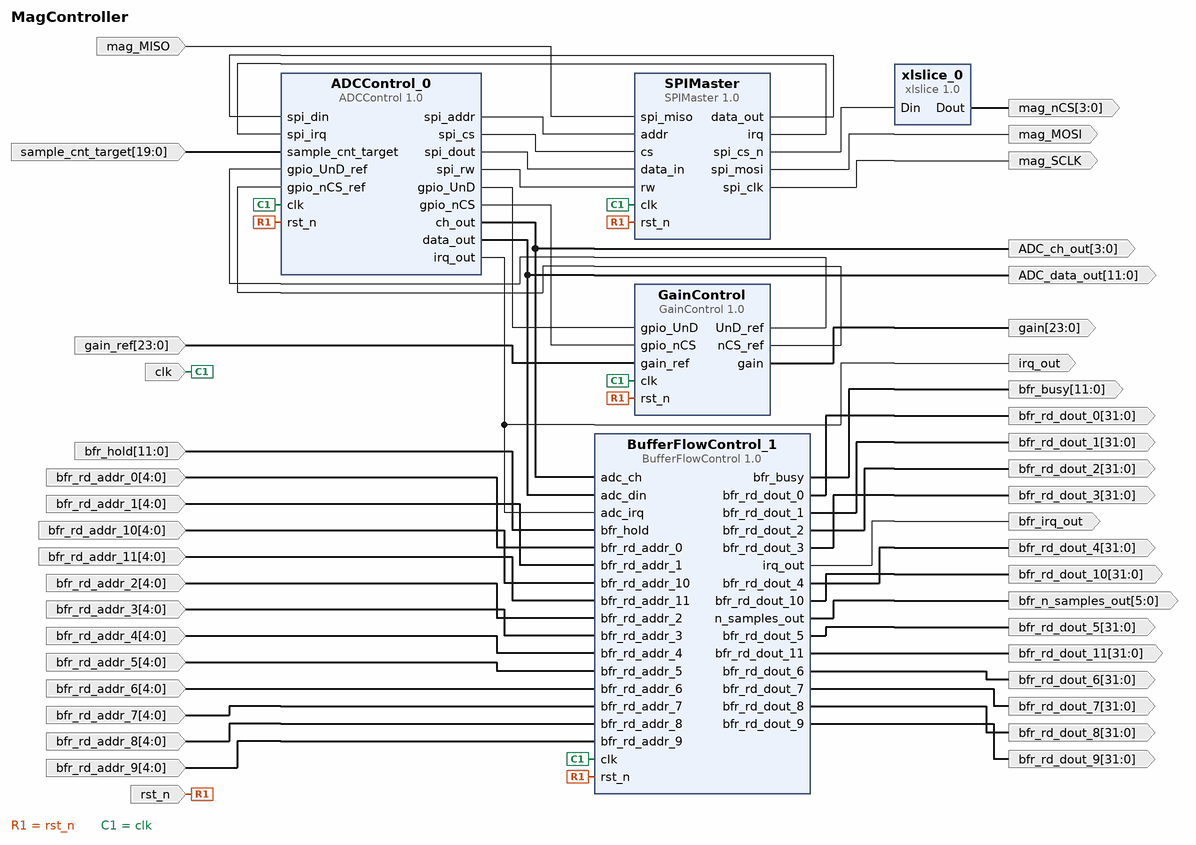
[diagram p0: block diagram of the top level]
# Vivado block design MagController, xczu3eg-sbva484-1-i, Vivado 2020.2
create_bd_design MagController

create_bd_port -dir O -from 3 -to 0 mag_nCS
create_bd_port -dir I mag_MISO
create_bd_port -dir I -type clk clk
create_bd_port -dir I -type rst rst_n
create_bd_port -dir O -type clk mag_SCLK
create_bd_port -dir O mag_MOSI
create_bd_port -dir O -from 11 -to 0 bfr_busy
create_bd_port -dir O -from 3 -to 0 ADC_ch_out
create_bd_port -dir O -from 11 -to 0 ADC_data_out
create_bd_port -dir O irq_out
create_bd_port -dir O bfr_irq_out
create_bd_port -dir O -from 5 -to 0 bfr_n_samples_out
create_bd_port -dir I -from 11 -to 0 bfr_hold
create_bd_port -dir O -from 31 -to 0 bfr_rd_dout_10
create_bd_port -dir I -from 4 -to 0 bfr_rd_addr_2
create_bd_port -dir I -from 4 -to 0 bfr_rd_addr_10
create_bd_port -dir I -from 4 -to 0 bfr_rd_addr_11
create_bd_port -dir O -from 31 -to 0 bfr_rd_dout_1
create_bd_port -dir O -from 31 -to 0 bfr_rd_dout_2
create_bd_port -dir I -from 4 -to 0 bfr_rd_addr_4
create_bd_port -dir I -from 4 -to 0 bfr_rd_addr_1
create_bd_port -dir O -from 31 -to 0 bfr_rd_dout_6
create_bd_port -dir I -from 4 -to 0 bfr_rd_addr_3
create_bd_port -dir O -from 31 -to 0 bfr_rd_dout_11
create_bd_port -dir O -from 31 -to 0 bfr_rd_dout_4
create_bd_port -dir I -from 4 -to 0 bfr_rd_addr_6
create_bd_port -dir O -from 31 -to 0 bfr_rd_dout_5
create_bd_port -dir O -from 31 -to 0 bfr_rd_dout_8
create_bd_port -dir I -from 4 -to 0 bfr_rd_addr_5
create_bd_port -dir O -from 31 -to 0 bfr_rd_dout_3
create_bd_port -dir I -from 4 -to 0 bfr_rd_addr_8
create_bd_port -dir O -from 31 -to 0 bfr_rd_dout_7
create_bd_port -dir I -from 4 -to 0 bfr_rd_addr_7
create_bd_port -dir O -from 31 -to 0 bfr_rd_dout_0
create_bd_port -dir I -from 4 -to 0 bfr_rd_addr_0
create_bd_port -dir I -from 4 -to 0 bfr_rd_addr_9
create_bd_port -dir O -from 31 -to 0 bfr_rd_dout_9
create_bd_port -dir I -from 23 -to 0 gain_ref
create_bd_port -dir O -from 23 -to 0 gain
create_bd_port -dir I -from 19 -to 0 sample_cnt_target

create_bd_cell -type ip -vlnv DIII:PL-Mag-Sensor:SPIMaster:1.0 SPIMaster
create_bd_cell -type ip -vlnv DIII:PL-Mag-Sensor:GainControl:1.0 GainControl
create_bd_cell -type ip -vlnv xilinx.com:ip:xlslice:1.0 xlslice_0
set_property -dict {CONFIG.DIN_FROM 3 CONFIG.DIN_WIDTH 8 CONFIG.DOUT_WIDTH 4} [get_bd_cells xlslice_0]
create_bd_cell -type ip -vlnv DIII:PL-Mag-Sensor:BufferFlowControl:1.0 BufferFlowControl_1
create_bd_cell -type ip -vlnv DIII:PL-Mag-Sensor:ADCControl:1.0 ADCControl_0

# ---- connections ----

connect_bd_net -net spi_miso_0_1 [get_bd_ports mag_MISO] [get_bd_pins SPIMaster/spi_miso]
connect_bd_net -net rst_n_0_1 [get_bd_ports rst_n] \
  [get_bd_pins SPIMaster/rst_n] [get_bd_pins GainControl/rst_n] [get_bd_pins BufferFlowControl_1/rst_n] \
  [get_bd_pins ADCControl_0/rst_n]
connect_bd_net -net clk_0_1 [get_bd_ports clk] \
  [get_bd_pins SPIMaster/clk] [get_bd_pins GainControl/clk] [get_bd_pins BufferFlowControl_1/clk] \
  [get_bd_pins ADCControl_0/clk]
connect_bd_net [get_bd_pins SPIMaster/spi_clk] [get_bd_ports mag_SCLK]
connect_bd_net [get_bd_pins SPIMaster/spi_mosi] [get_bd_ports mag_MOSI]
connect_bd_net [get_bd_pins GainControl/UnD_ref] [get_bd_pins ADCControl_0/gpio_UnD_ref]
connect_bd_net [get_bd_pins GainControl/nCS_ref] [get_bd_pins ADCControl_0/gpio_nCS_ref]
connect_bd_net [get_bd_pins SPIMaster/data_out] [get_bd_pins ADCControl_0/spi_din]
connect_bd_net [get_bd_pins SPIMaster/irq] [get_bd_pins ADCControl_0/spi_irq]
connect_bd_net [get_bd_pins ADCControl_0/ch_out] [get_bd_ports ADC_ch_out] [get_bd_pins BufferFlowControl_1/adc_ch]
connect_bd_net [get_bd_pins ADCControl_0/data_out] [get_bd_ports ADC_data_out] [get_bd_pins BufferFlowControl_1/adc_din]
connect_bd_net [get_bd_pins ADCControl_0/gpio_UnD] [get_bd_pins GainControl/gpio_UnD]
connect_bd_net [get_bd_pins ADCControl_0/gpio_nCS] [get_bd_pins GainControl/gpio_nCS]
connect_bd_net [get_bd_pins ADCControl_0/irq_out] [get_bd_ports irq_out] [get_bd_pins BufferFlowControl_1/adc_irq]
connect_bd_net [get_bd_pins ADCControl_0/spi_addr] [get_bd_pins SPIMaster/addr]
connect_bd_net [get_bd_pins ADCControl_0/spi_cs] [get_bd_pins SPIMaster/cs]
connect_bd_net [get_bd_pins ADCControl_0/spi_dout] [get_bd_pins SPIMaster/data_in]
connect_bd_net [get_bd_pins ADCControl_0/spi_rw] [get_bd_pins SPIMaster/rw]
connect_bd_net [get_bd_pins SPIMaster/spi_cs_n] [get_bd_pins xlslice_0/Din]
connect_bd_net [get_bd_pins xlslice_0/Dout] [get_bd_ports mag_nCS]
connect_bd_net [get_bd_pins BufferFlowControl_1/bfr_busy] [get_bd_ports bfr_busy]
connect_bd_net [get_bd_pins BufferFlowControl_1/bfr_rd_dout_0] [get_bd_ports bfr_rd_dout_0]
connect_bd_net [get_bd_pins BufferFlowControl_1/bfr_rd_dout_1] [get_bd_ports bfr_rd_dout_1]
connect_bd_net [get_bd_pins BufferFlowControl_1/bfr_rd_dout_10] [get_bd_ports bfr_rd_dout_10]
connect_bd_net [get_bd_pins BufferFlowControl_1/bfr_rd_dout_11] [get_bd_ports bfr_rd_dout_11]
connect_bd_net [get_bd_pins BufferFlowControl_1/bfr_rd_dout_2] [get_bd_ports bfr_rd_dout_2]
connect_bd_net [get_bd_pins BufferFlowControl_1/bfr_rd_dout_3] [get_bd_ports bfr_rd_dout_3]
connect_bd_net [get_bd_pins BufferFlowControl_1/bfr_rd_dout_4] [get_bd_ports bfr_rd_dout_4]
connect_bd_net [get_bd_pins BufferFlowControl_1/bfr_rd_dout_5] [get_bd_ports bfr_rd_dout_5]
connect_bd_net [get_bd_pins BufferFlowControl_1/bfr_rd_dout_6] [get_bd_ports bfr_rd_dout_6]
connect_bd_net [get_bd_pins BufferFlowControl_1/bfr_rd_dout_7] [get_bd_ports bfr_rd_dout_7]
connect_bd_net [get_bd_pins BufferFlowControl_1/bfr_rd_dout_8] [get_bd_ports bfr_rd_dout_8]
connect_bd_net [get_bd_pins BufferFlowControl_1/bfr_rd_dout_9] [get_bd_ports bfr_rd_dout_9]
connect_bd_net [get_bd_pins BufferFlowControl_1/irq_out] [get_bd_ports bfr_irq_out]
connect_bd_net [get_bd_pins BufferFlowControl_1/n_samples_out] [get_bd_ports bfr_n_samples_out]
connect_bd_net [get_bd_ports bfr_hold] [get_bd_pins BufferFlowControl_1/bfr_hold]
connect_bd_net -net bfr_rd_addr_0_1 [get_bd_ports bfr_rd_addr_0] [get_bd_pins BufferFlowControl_1/bfr_rd_addr_0]
connect_bd_net -net bfr_rd_addr_1_1 [get_bd_ports bfr_rd_addr_1] [get_bd_pins BufferFlowControl_1/bfr_rd_addr_1]
connect_bd_net -net bfr_rd_addr_10_1 [get_bd_ports bfr_rd_addr_10] [get_bd_pins BufferFlowControl_1/bfr_rd_addr_10]
connect_bd_net -net bfr_rd_addr_11_1 [get_bd_ports bfr_rd_addr_11] [get_bd_pins BufferFlowControl_1/bfr_rd_addr_11]
connect_bd_net -net bfr_rd_addr_2_1 [get_bd_ports bfr_rd_addr_2] [get_bd_pins BufferFlowControl_1/bfr_rd_addr_2]
connect_bd_net -net bfr_rd_addr_3_1 [get_bd_ports bfr_rd_addr_3] [get_bd_pins BufferFlowControl_1/bfr_rd_addr_3]
connect_bd_net -net bfr_rd_addr_4_1 [get_bd_ports bfr_rd_addr_4] [get_bd_pins BufferFlowControl_1/bfr_rd_addr_4]
connect_bd_net -net bfr_rd_addr_5_1 [get_bd_ports bfr_rd_addr_5] [get_bd_pins BufferFlowControl_1/bfr_rd_addr_5]
connect_bd_net -net bfr_rd_addr_6_1 [get_bd_ports bfr_rd_addr_6] [get_bd_pins BufferFlowControl_1/bfr_rd_addr_6]
connect_bd_net -net bfr_rd_addr_7_1 [get_bd_ports bfr_rd_addr_7] [get_bd_pins BufferFlowControl_1/bfr_rd_addr_7]
connect_bd_net -net bfr_rd_addr_8_1 [get_bd_ports bfr_rd_addr_8] [get_bd_pins BufferFlowControl_1/bfr_rd_addr_8]
connect_bd_net -net bfr_rd_addr_9_1 [get_bd_ports bfr_rd_addr_9] [get_bd_pins BufferFlowControl_1/bfr_rd_addr_9]
connect_bd_net -net gain_ref_0_1 [get_bd_ports gain_ref] [get_bd_pins GainControl/gain_ref]
connect_bd_net [get_bd_pins GainControl/gain] [get_bd_ports gain]
connect_bd_net -net sample_cnt_target_0_1 [get_bd_ports sample_cnt_target] [get_bd_pins ADCControl_0/sample_cnt_target]

validate_bd_design
save_bd_design
